# Altium schematic sheet drive.SchDoc
size 400 x 289 mm
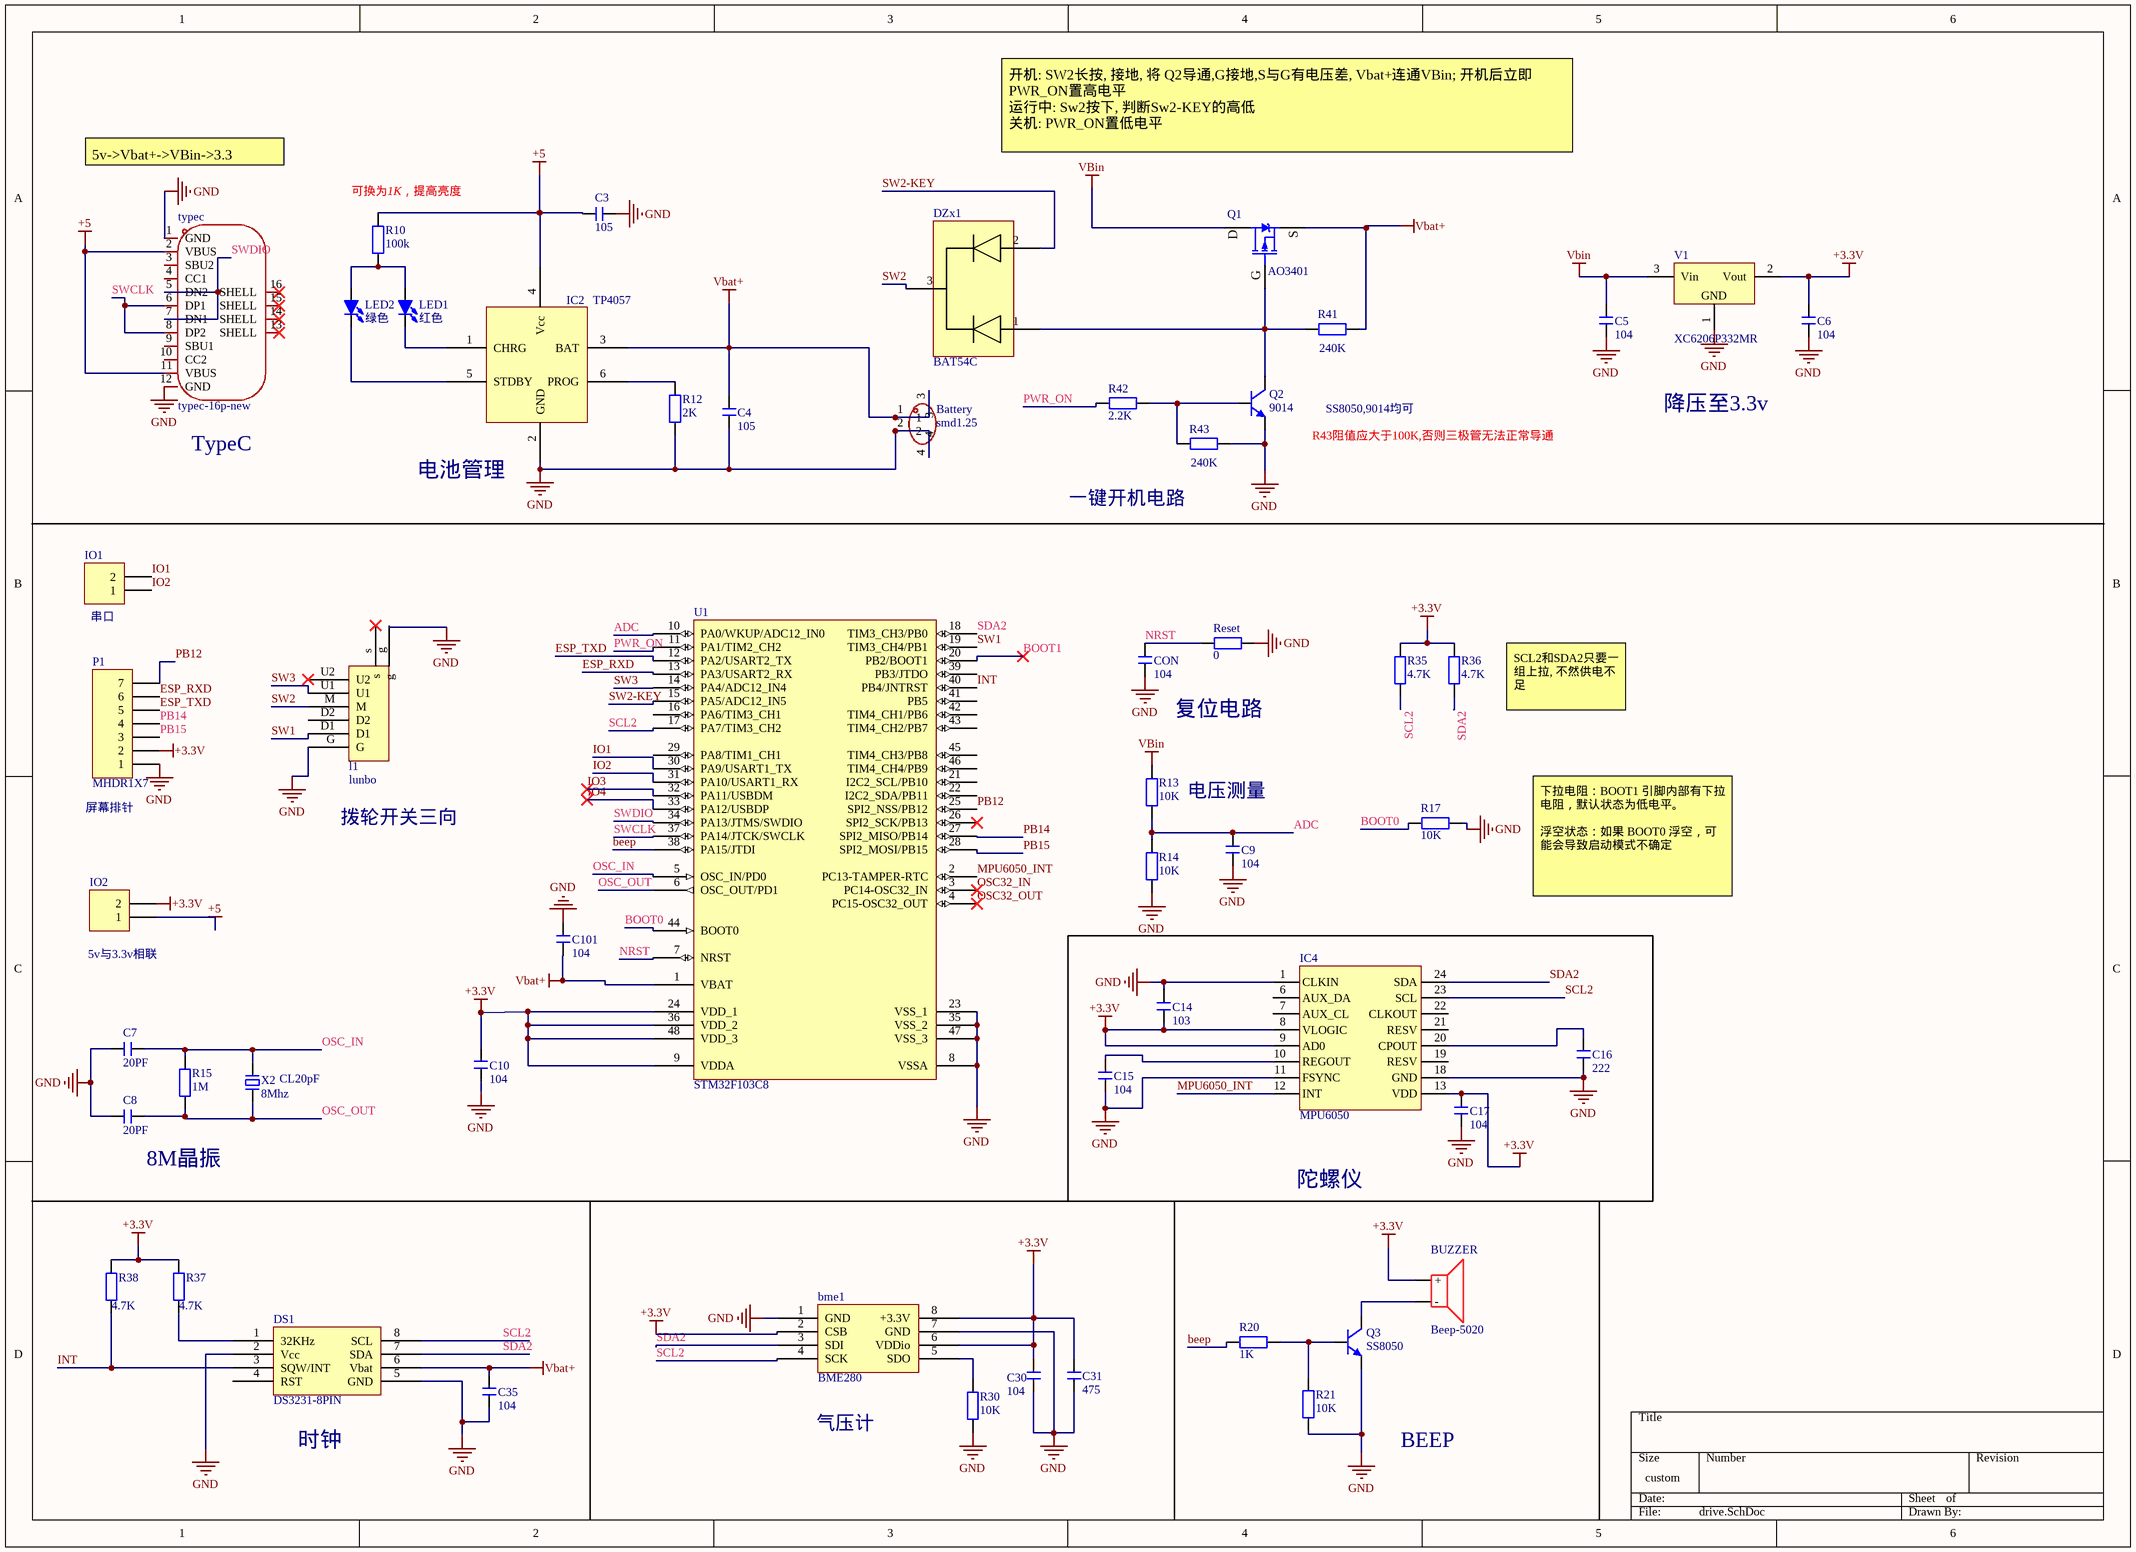
[diagram p0: drive.SchDoc]

## Parts
Battery  smd1.25  [smd-1.25]
bme1  BME280  [BME280]
BUZZER  Beep-5020  [5020BUZZER]
C3  105  [C 0603_L]
C4  105  [C 0603_L]
C5  104  [C 0603_L]
C6  104  [C 0603_L]
C7  20PF  [C 0603_L]
C8  20PF  [C 0603_L]
C9  104  [C 0603_L]
C10  104  [C 0603_L]
C14  103  [C 0603_L]
C15  104  [C 0603_L]
C16  222  [C 0603_L]
C17  104  [C 0603_L]
C30  104  [C 0603_L]
C31  475  [C 0603_L]
C35  104  [C 0603_L]
C101  104  [C 0603_L]
CON  104  [C 0603_L]
DS1  DS3231-8PIN  [SOP8_N]
DZx1  BAT54C  [SOT23-3N]
IC2  TP4057  [SOT23-6N]
IC4  MPU6050  [QFN24 4x4_M]
IO1  串口  [MHDR1X2]
IO2  5v与3.3v相联  [MHDR1X2]
l1  lunbo  [lunbo]
LED1  红色  [LED 0603R]
LED2  绿色  [LED 0603G]
P1  MHDR1X7  [MHDR1X7]
Q1  AO3401  [SOT23-3N]
Q2  9014  [SOT23-3N]
Q3  SS8050  [SOT23-3N]
R10  100k  [R 0603_L]
R12  2K  [R 0603_L]
R13  10K  [R 0603_L]
R14  10K  [R 0603_L]
R15  1M  [R 0603_L]
R17  10K  [R 0603_L]
R20  1K  [R 0603_L]
R21  10K  [R 0603_L]
R30  10K  [R 0603_L]
R35  4.7K  [R 0603_L]
R36  4.7K  [R 0603_L]
R37  4.7K  [R 0603_L]
R38  4.7K  [R 0603_L]
R41  240K  [R 0603_L]
R42  2.2K  [R 0603_L]
R43  240K  [R 0603_L]
Reset  0  [C0603]
typec  typec-16p-new  [type-c-16p-new]
U1  STM32F103C8  [LQFP48 7X7_M]
V1  XC6206P332MR  [SOT23-3N]
X2  8Mhz  负载电容: CL20pF  [OSC 5032-2P]

## Nets
+3.3V: bme1.2(CSB) bme1.6(VDDio) bme1.8(+3.3V) BUZZER.1(+) C6.2 C10.2 C14.1 C17.2 C30.2 C31.2 IC4.8(VLOGIC) IC4.9(AD0) IC4.13(VDD) IO2.2 P1.2 R35.2 R36.2 R37.2 R38.2 U1.9(VDDA) U1.24(VDD_1) U1.36(VDD_2) U1.48(VDD_3) V1.2(Vout)
+5: C3.2 IC2.4(Vcc) IO2.1 R10.2 typec.2(VBUS) typec.11(VBUS)
GND: Battery.2 Battery.4 bme1.1(GND) bme1.7(GND) C3.1 C4.1 C5.1 C6.1 C7.1 C8.1 C9.1 C10.1 C14.2 C15.1 C16.1 C17.1 C30.1 C31.1 C35.1 C101.1 CON.1 DS1.2(Vcc) DS1.5(GND) IC2.2(GND) IC4.1(CLKIN) IC4.11(FSYNC) IC4.18(GND) l1.G l1.g P1.1 Q2.2(E) Q3.2(E) R12.1 R14.1 R17.2 R21.1 R30.1 R43.2 Reset.1 typec.1(GND) typec.12(GND) U1.8(VSSA) U1.23(VSS_1) U1.35(VSS_2) U1.47(VSS_3) V1.1(GND)
Vbat+: Battery.1 Battery.3 C4.2 C35.2 C101.2 DS1.6(Vbat) IC2.3(BAT) Q1.2(S) R41.2 U1.1(VBAT)
Vbin: C5.2 Q1.3(D) R13.2 V1.3(Vin)
ADC: C9.2 R13.1 R14.2 U1.10(PA0/WKUP/ADC12_IN0)
beep: R20.1 U1.38(PA15/JTDI)
BOOT0: R17.1 U1.44(BOOT0)
BOOT1: U1.20(PB2/BOOT1)
ESP_RXD: P1.6 U1.13(PA3/USART2_RX)
ESP_TXD: P1.5 U1.12(PA2/USART2_TX)
INT: DS1.3(SQW/INT) R38.1 U1.40(PB4/JNTRST)
IO1: IO1.2 U1.30(PA9/USART1_TX)
IO2: IO1.1 U1.31(PA10/USART1_RX)
IO3: U1.32(PA11/USBDM)
IO4: U1.33(PA12/USBDP)
MPU6050_INT: IC4.12(INT) U1.2(PC13-TAMPER-RTC)
NRST: CON.2 Reset.2 U1.7(NRST)
OSC32_IN: U1.3(PC14-OSC32_IN)
OSC32_OUT: U1.4(PC15-OSC32_OUT)
OSC_IN: C7.2 R15.2 U1.5(OSC_IN/PD0) X2.2
OSC_OUT: C8.2 R15.1 U1.6(OSC_OUT/PD1) X2.1
PB12: P1.7 U1.25(SPI2_NSS/PB12)
PB14: P1.4 U1.27(SPI2_MISO/PB14)
PB15: P1.3 U1.28(SPI2_MOSI/PB15)
PWR_ON: R42.1 U1.11(PA1/TIM2_CH2)
SCL2: bme1.4(SCK) DS1.8(SCL) IC4.23(SCL) R35.1 U1.17(PA7/TIM3_CH2)
SDA2: bme1.3(SDI) DS1.7(SDA) IC4.24(SDA) R36.1 U1.18(TIM3_CH3/PB0)
SW1: l1.D1 U1.19(TIM3_CH4/PB1)
SW2: DZx1.3 l1.M
SW2-KEY: DZx1.2 U1.15(PA5/ADC12_IN5)
SW3: l1.U1 U1.14(PA4/ADC12_IN4)
SWCLK: typec.6(DP1) typec.8(DP2) U1.37(PA14/JTCK/SWCLK)
SWDIO: typec.5(DN2) typec.7(DN1) U1.34(PA13/JTMS/SWDIO)
Netbme1_5: bme1.5(SDO) R30.2
NetBUZZER_2: BUZZER.2(-) Q3.3(C)
NetC15_2: C15.2 IC4.10(REGOUT)
NetC16_2: C16.2 IC4.20(CPOUT)
NetDS1_1: DS1.1(32KHz) R37.1
NetDZx1_1: DZx1.1 Q1.1(G) Q2.3(C) R41.1
NetIC2_1: IC2.1(CHRG) LED1.2(K)
NetIC2_5: IC2.5(STDBY) LED2.2(K)
NetIC2_6: IC2.6(PROG) R12.2
NetLED1_1: LED1.1(A) LED2.1(A) R10.1
NetQ2_1: Q2.1(B) R42.2 R43.1
NetQ3_1: Q3.1(B) R20.2 R21.2

Not connected (* = marked no-connect by the designer): DS1 4(RST); IC4 6(AUX_DA) 7(AUX_CL) 19(RESV) 21(RESV) 22(CLKOUT); l1 D2 s* U2*; typec 3(SBU2) 4(CC1) 9(SBU1) 10(CC2) 13(SHELL)* 14(SHELL)* 15(SHELL)* 16(SHELL)*; U1 16(PA6/TIM3_CH1) 21(I2C2_SCL/PB10) 22(I2C2_SDA/PB11) 26(SPI2_SCK/PB13)* 29(PA8/TIM1_CH1) 39(PB3/JTDO) 41(PB5) 42(TIM4_CH1/PB6) 43(TIM4_CH2/PB7) 45(TIM4_CH3/PB8) 46(TIM4_CH4/PB9)

## Notes on the sheet
- 开机: SW2长按, 接地, 将 Q2导通,G接地,S与G有电压差, Vbat+连通VBin; 开机后立即PWR_ON置高电平
  运行中: Sw2按下, 判断Sw2-KEY的高低
  关机: PWR_ON置低电平
- 5v->Vbat+->VBin->3.3
- (near R10) 可换为1K，提高亮度
- SS8050,9014均可
- 降压至3.3v
- (near typec) TypeC
- (near IC2) 电池管理
- (near Q2) R43阻值应大于100K,否则三极管无法正常导通
- 一键开机电路
- 复位电路
- (near R36) SCL2和SDA2只要一组上拉, 不然供电不足
- (near P1) 屏幕排针
- 拨轮开关三向
- 电压测量
- 下拉电阻：BOOT1 引脚内部有下拉电阻，默认状态为低电平。
  浮空状态：如果 BOOT0 浮空，可能会导致启动模式不确定
- 8M晶振
- 陀螺仪
- 气压计
- (near DS1) 时钟
- BEEP

## Library data of the parts
bme1 = BME280: 气压，湿度，温度传感器
BUZZER = Beep-5020: 贴片蜂鸣器5020最小封装
C3 C4 C14-C17 C35 = C: 无极性贴片电容; 版权归属: 源创客; BOM名称: 无极性贴片电容; 学习资源: www.ooocke.com
C5-C10 C30 C31 C101 CON = C: 无极性贴片电容; 版权归属: 源创客; 材质: X7R; BOM名称: 无极性贴片电容; 学习资源: www.ooocke.com
DZx1 = BAT54C: 双肖特基，共阴极
IC2 = TP4057/4059: 500mA/600mA锂电池充电管理IC
IC4 = MPU6050: 陀螺仪
IO1 IO2 = Header 2: Header, 2-Pin; LatestRevisionDate: 17-Jul-2002; LatestRevisionNote: Re-released for DXP Platform.; Publisher: Altium Limited
LED1 LED2 = LED-SMD: 贴片LED; 版权归属: 源创客; BOM名称: 贴片LED; 学习资源: www.ooocke.com
P1 = MHDR1X7: Header, 7-Pin; LatestRevisionDate: 17-Jul-2002; LatestRevisionNote: Re-released for DXP Platform.; Publisher: Altium Limited
Q1 = SI2301: P沟道场效应管; 版权归属: 源创客; BOM名称: P沟道场效应管; 学习资源: www.ooocke.com
Q2 = 9014-SMD: 低噪放大-NPN型; 版权归属: 源创客; 属性: 50V 0.1A 0.4W 150MHZ; BOM名称: 低噪放大-NPN型; 学习资源: www.ooocke.com
Q3 = 8050-SMD: 高频放大-NPN型; 版权归属: 源创客; 属性: 40V 1.5A 1W 100MHZ; BOM名称: 高频放大-NPN型; 学习资源: www.ooocke.com
R10 R12-R15 R17 R20 R21 R30 R35-R38 R41-R43 Reset = R: 贴片电阻; 版权归属: 源创客; BOM名称: 贴片电阻; 学习资源: www.ooocke.com
U1 = STM32F103C8: Flaah:64/RAM:20/IO:36; BOM名称: 32位STM单片机; 版权归属: 源创客; 学习资源: www.ooocke.com
V1 = XC6206P332MR: 低压差线性稳压芯片; 版权归属: 源创客; BOM名称: 低压差线性稳压芯片; 学习资源: www.ooocke.com
X2 = XTAL-2P: 2脚无源脚晶振; 版权归属: 源创客; BOM名称: 2脚无源脚晶振; 学习资源: www.ooocke.com